# Altium schematic sheet 0127_EC - MISCELLANEOUS.SchDoc
size A3
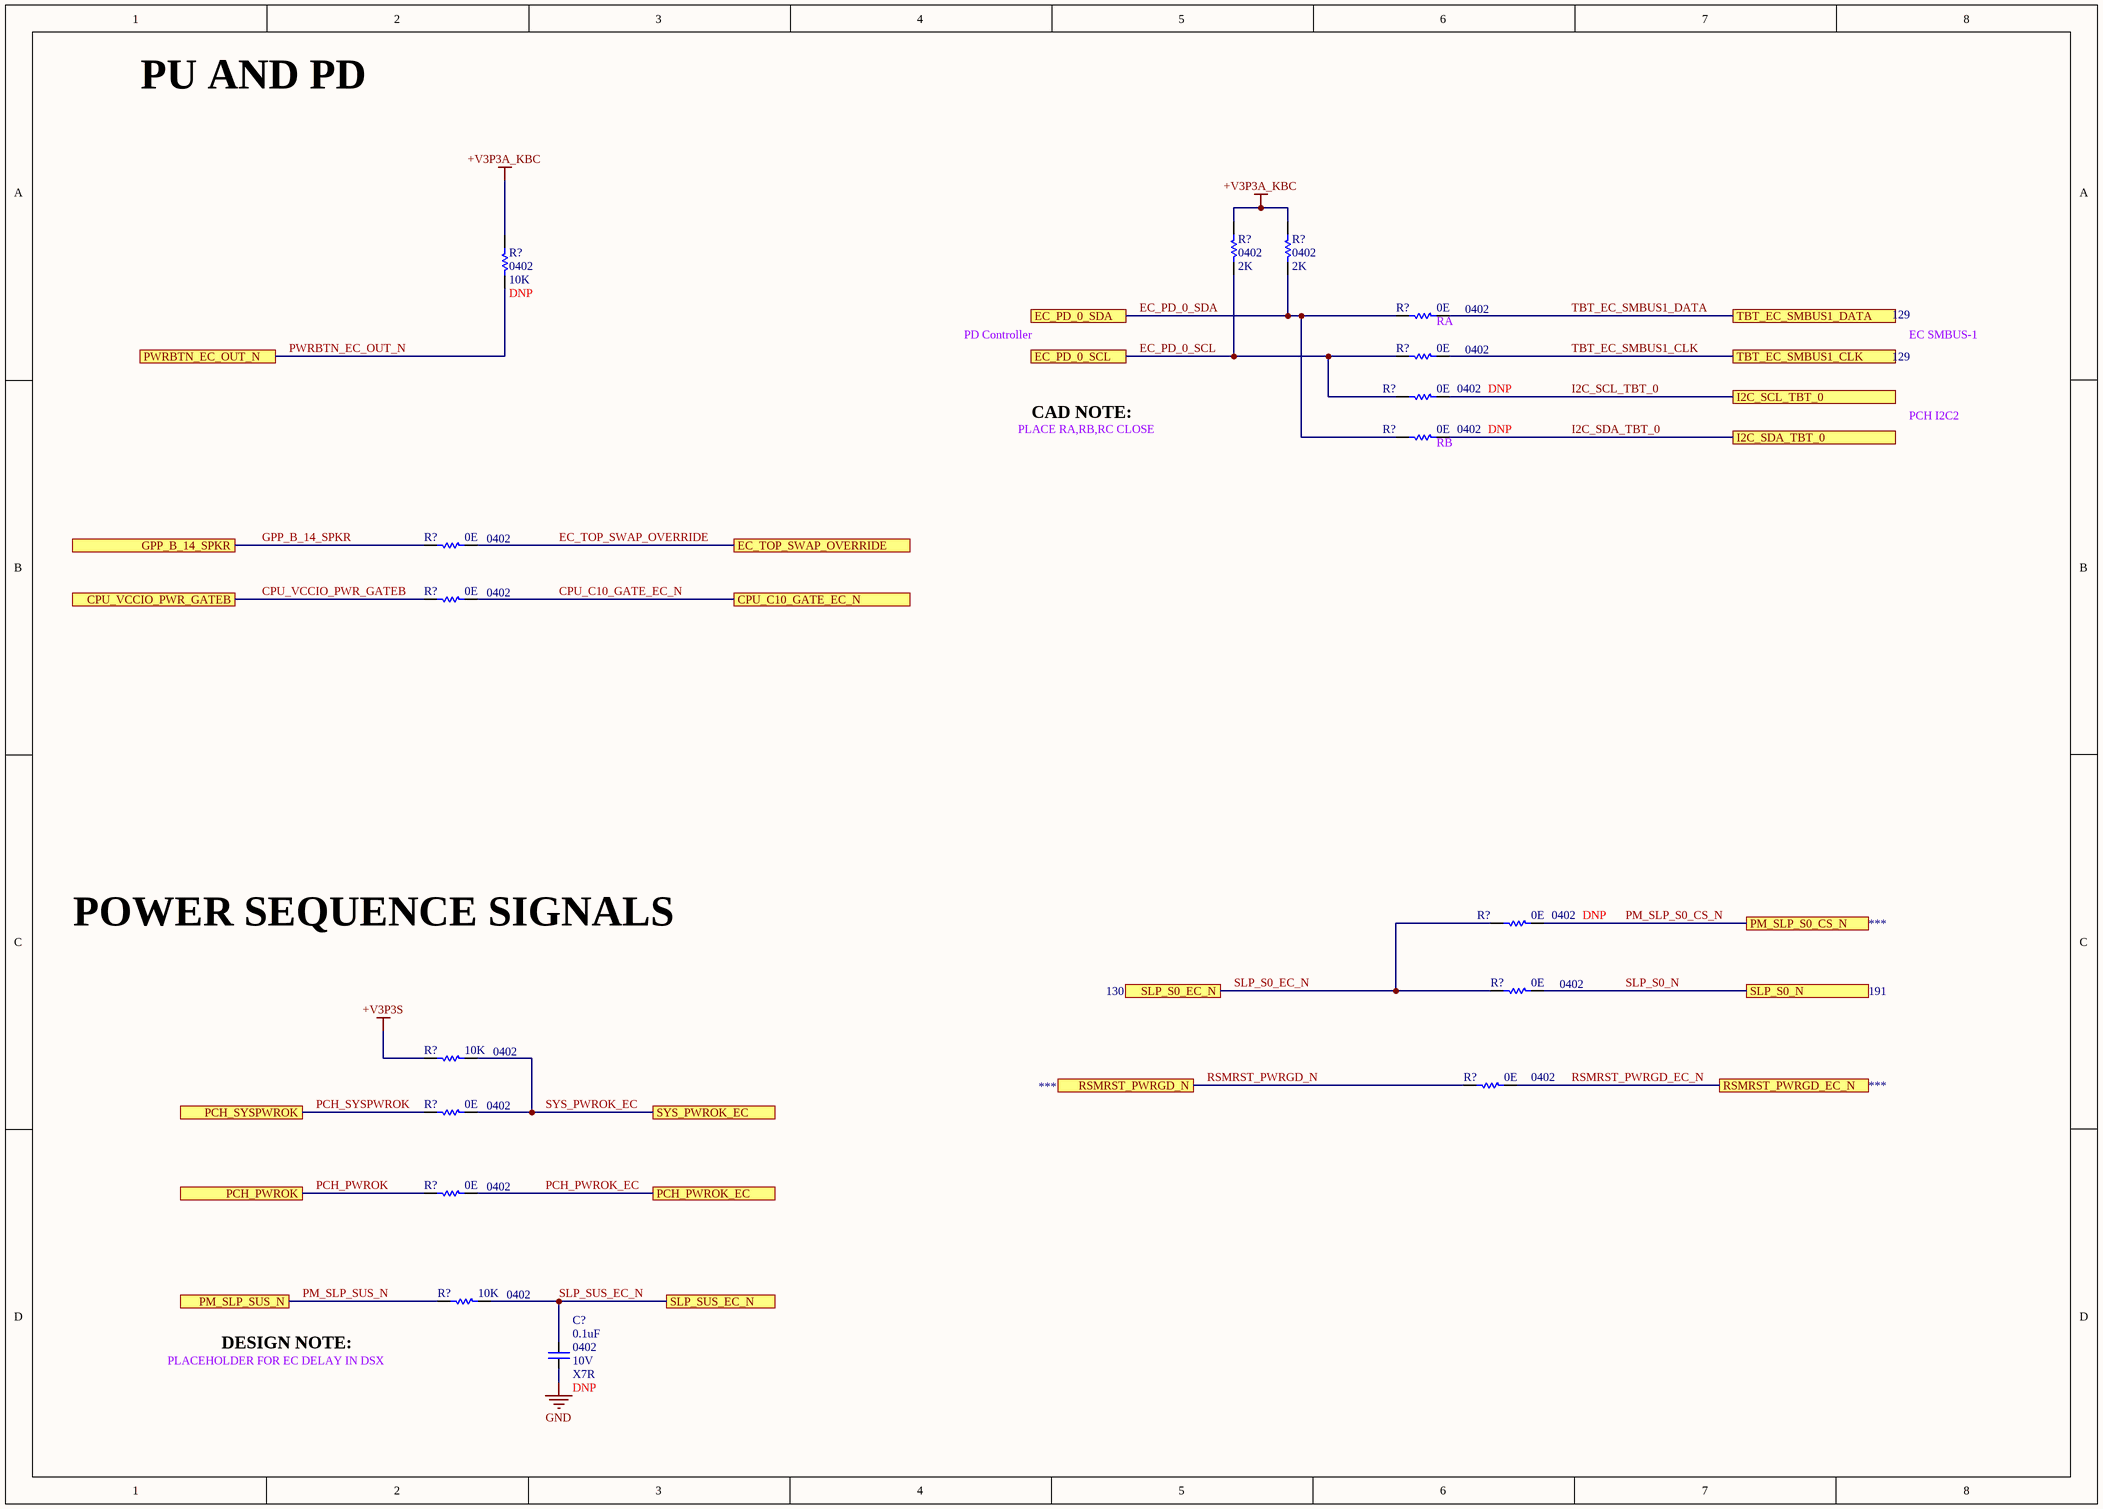
[diagram p0: 0127_EC - MISCELLANEOUS.SchDoc]

## Parts
(Parts that share a designator on the sheet are numbered #1, #2 ... from top to bottom, then left to right.)
C?  value 0.1uF  Case/Package: 0402  Voltage: 10V  Dielectric: X7R  [CAPC0402]
R?#1  value 2K  Case/Package: 0402  [RESC0402]  (hidden comment: Res)
R?#2  value 2K  Case/Package: 0402  [RESC0402]  (hidden comment: Res)
R?#3  value 10K  Case/Package: 0402  [RESC0402]  (hidden comment: Res)
R?#4  value 0E  Case/Package: 0402  [RESC0402]  (hidden comment: Res)
R?#5  value 0E  Case/Package: 0402  [RESC0402]  (hidden comment: Res)
R?#6  value 0E  Case/Package: 0402  [RESC0402]  (hidden comment: Res)
R?#7  value 0E  Case/Package: 0402  [RESC0402]  (hidden comment: Res)
R?#8  value 0E  Case/Package: 0402  [RESC0402]  (hidden comment: Res)
R?#9  value 0E  Case/Package: 0402  [RESC0402]  (hidden comment: Res)
R?#10  value 0E  Case/Package: 0402  [RESC0402]  (hidden comment: Res)
R?#11  value 0E  Case/Package: 0402  [RESC0402]  (hidden comment: Res)
R?#12  value 10K  Case/Package: 0402  [RESC0402]  (hidden comment: Res)
R?#13  value 0E  Case/Package: 0402  [RESC0402]  (hidden comment: Res)
R?#14  value 0E  Case/Package: 0402  [RESC0402]  (hidden comment: Res)
R?#15  value 0E  Case/Package: 0402  [RESC0402]  (hidden comment: Res)
R?#16  value 10K  Case/Package: 0402  [RESC0402]  (hidden comment: Res)

## Ports
CPU_C10_GATE_EC_N, CPU_VCCIO_PWR_GATEB, EC_PD_0_SCL, EC_PD_0_SDA, EC_TOP_SWAP_OVERRIDE, GPP_B_14_SPKR, I2C_SCL_TBT_0, I2C_SDA_TBT_0, PCH_PWROK, PCH_PWROK_EC, PCH_SYSPWROK, PM_SLP_S0_CS_N, PM_SLP_SUS_N, PWRBTN_EC_OUT_N, RSMRST_PWRGD_EC_N, RSMRST_PWRGD_N, SLP_S0_EC_N, SLP_S0_N, SLP_SUS_EC_N, SYS_PWROK_EC, TBT_EC_SMBUS1_CLK, TBT_EC_SMBUS1_DATA

## Nets
+V3P3A_KBC: R?#1.2 R?#2.2 R?#3.1
+V3P3S: R?#12.1
GND: C?.1
CPU_C10_GATE_EC_N: R?#9.2 ; port CPU_C10_GATE_EC_N
CPU_VCCIO_PWR_GATEB: R?#9.1 ; port CPU_VCCIO_PWR_GATEB
EC_PD_0_SCL: R?#1.1 R?#5.1 R?#6.1 ; port EC_PD_0_SCL
EC_PD_0_SDA: R?#2.1 R?#4.1 R?#7.1 ; port EC_PD_0_SDA
EC_TOP_SWAP_OVERRIDE: R?#8.2 ; port EC_TOP_SWAP_OVERRIDE
GPP_B_14_SPKR: R?#8.1 ; port GPP_B_14_SPKR
I2C_SCL_TBT_0: R?#6.2 ; port I2C_SCL_TBT_0
I2C_SDA_TBT_0: R?#7.2 ; port I2C_SDA_TBT_0
PCH_PWROK: R?#15.1 ; port PCH_PWROK
PCH_PWROK_EC: R?#15.2 ; port PCH_PWROK_EC
PCH_SYSPWROK: R?#14.1 ; port PCH_SYSPWROK
PM_SLP_S0_CS_N: R?#10.2 ; port PM_SLP_S0_CS_N
PM_SLP_SUS_N: R?#16.1 ; port PM_SLP_SUS_N
PWRBTN_EC_OUT_N: R?#3.2 ; port PWRBTN_EC_OUT_N
RSMRST_PWRGD_EC_N: R?#13.2 ; port RSMRST_PWRGD_EC_N
RSMRST_PWRGD_N: R?#13.1 ; port RSMRST_PWRGD_N
SLP_S0_EC_N: R?#10.1 R?#11.1 ; port SLP_S0_EC_N
SLP_S0_N: R?#11.2 ; port SLP_S0_N
SLP_SUS_EC_N: C?.2 R?#16.2 ; port SLP_SUS_EC_N
SYS_PWROK_EC: R?#12.2 R?#14.2 ; port SYS_PWROK_EC
TBT_EC_SMBUS1_CLK: R?#5.2 ; port TBT_EC_SMBUS1_CLK
TBT_EC_SMBUS1_DATA: R?#4.2 ; port TBT_EC_SMBUS1_DATA

## Notes on the sheet
- PU AND PD
- PD Controller
- (near R?#4) RA
- EC SMBUS-1
- PLACE RA,RB,RC CLOSE
- CAD NOTE:
- (near R?#7) RB
- PCH I2C2
- POWER SEQUENCE SIGNALS
- PLACEHOLDER FOR EC DELAY IN DSX
- DESIGN NOTE:

## Library data of the parts
C? = Cap: CAP CER 0.1uF 10V X7R 0402; DNP: DNP
R?#1 R?#2 = Res: Thick Film Resistor -  2Kohm, 1%,0402
R?#3 R?#12 R?#16 = Res: Thick Film Resistor -  10Kohm, 1%,0402
  R?#3: DNP: DNP
R?#4-R?#11 R?#13-R?#15 = Res: Thick Film Resistor -  0ohm, 1%,0402
  R?#6 R?#7 R?#10: DNP: DNP